# Altium schematic sheet relay.SchDoc
size A4
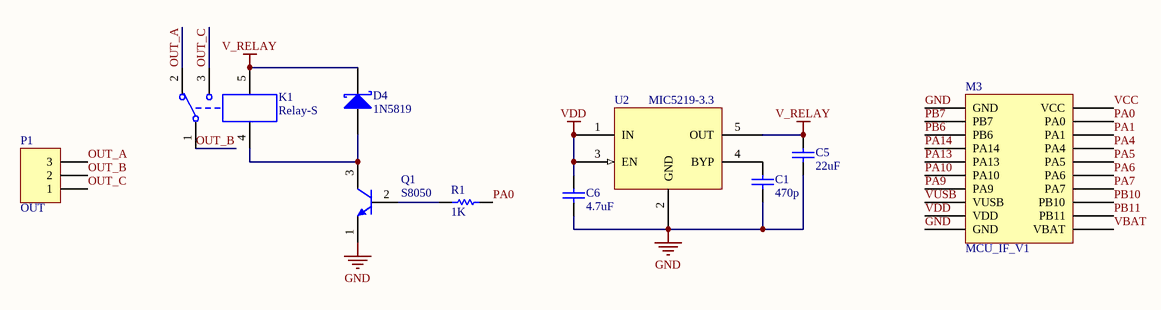
[diagram p0: relay.SchDoc]

## Parts
C1  value 470p  [C-1608[0603]]  (hidden comment: Cap Semi)
C5  value 22uF  [C-2012[0805]]  (hidden comment: Cap Semi)
C6  value 4.7uF  [C-1608[0603]]  (hidden comment: Cap Semi)
D4  1N5819  [SOD123]
K1  Relay-S  [Relay-JZC-32F-ZS]
M3  MCU_IF_V1  [MCU_IF_V1]
P1  OUT  [Edge5.08mm3P]
Q1  S8050  [SOT23B]
R1  value 1K  [R-1608[0603]]  (hidden comment: Res Semi)
U2  MIC5219-3.3  [SOT23-5]

## Nets
GND: C1.2 C5.2 C6.2 M3.1(GND) M3.10(GND) Q1.1(E) U2.2(GND)
V_RELAY: C5.1 D4.2(K) K1.5 U2.5(OUT)
VDD: C6.1 M3.9(VDD) U2.1(IN) U2.3(EN)
OUT_A: K1.2 P1.3
OUT_B: K1.1 P1.2
OUT_C: K1.3 P1.1
PA0: M3.19(PA0) R1.2
PA1: M3.18(PA1)
PA4: M3.17(PA4)
PA5: M3.16(PA5)
PA6: M3.15(PA6)
PA7: M3.14(PA7)
PA9: M3.7(PA9)
PA10: M3.6(PA10)
PA13: M3.5(PA13)
PA14: M3.4(PA14)
PB6: M3.3(PB6)
PB7: M3.2(PB7)
PB10: M3.13(PB10)
PB11: M3.12(PB11)
VBAT: M3.11(VBAT)
VCC: M3.20(VCC)
VUSB: M3.8(VUSB)
NetC1_1: C1.1 U2.4(BYP)
NetD4_1: D4.1(A) K1.4 Q1.3(C)
NetQ1_2: Q1.2(B) R1.1

## Library data of the parts
C1 C5 C6 = Cap Semi: Capacitor (Semiconductor SIM Model); Published: 8-Jun-2000; LatestRevisionDate: 29-May-2009; LatestRevisionNote: IPC-7351 Footprint Added.; PackageReference: C1206; Publisher: Altium Limited; PackageDescription: Chip Capacitor
D4 = D Schottky: Schottky Diode; Published: 8-Jun-2000; LatestRevisionDate: 17-Jul-2002; LatestRevisionNote: Re-released for DXP Platform.; Publisher: Altium Limited
K1 = Relay-SPDT: Single-Pole Dual-Throw Relay; Published: 24-Mar-1999; LatestRevisionDate: 17-Jul-2002; LatestRevisionNote: Re-released for DXP Platform.; PackageReference: MODULE5B; Publisher: Altium Limited
P1 = Header 3: Header, 3-Pin; LatestRevisionDate: 17-Jul-2002; LatestRevisionNote: Re-released for DXP Platform.; Publisher: Altium Limited
Q1 = 2N3904: NPN General Purpose Amplifier; pin to pad: 1>2 2>1; Published: 8-Jun-2000; LatestRevisionDate: 15-Jan-2003; LatestRevisionNote: PCB Footprint 'BCY-W3/D4.7' replaced; DatasheetDocument: 1997; PackageDocument: Sep-1998; PackageReference: TO-92A; Publisher: Altium Limited; Code_JEDEC: TO-92A; ComponentLink1Description: Manufacturer Link; ComponentLink1URL: http://www.fairchildsemi.com/; ComponentLink2Description: Datasheet; ComponentLink2URL: http://www.fairchildsemi.com/ds/2N%2F2N3904.pdf
R1 = Res Semi: Semiconductor Resistor; Published: 8-Jun-2000; LatestRevisionDate: 17-Jul-2002; LatestRevisionNote: Re-released for DXP Platform.; PackageReference: AXIAL-0.5; Publisher: Altium Limited
U2 = MIC5219: 500mA-Peak Output LDO Regulator